# Altium schematic sheet Revisies.SchDoc: Ulticontroller
size A4; CompanyName: Ultimaker; Revision: 1994-E
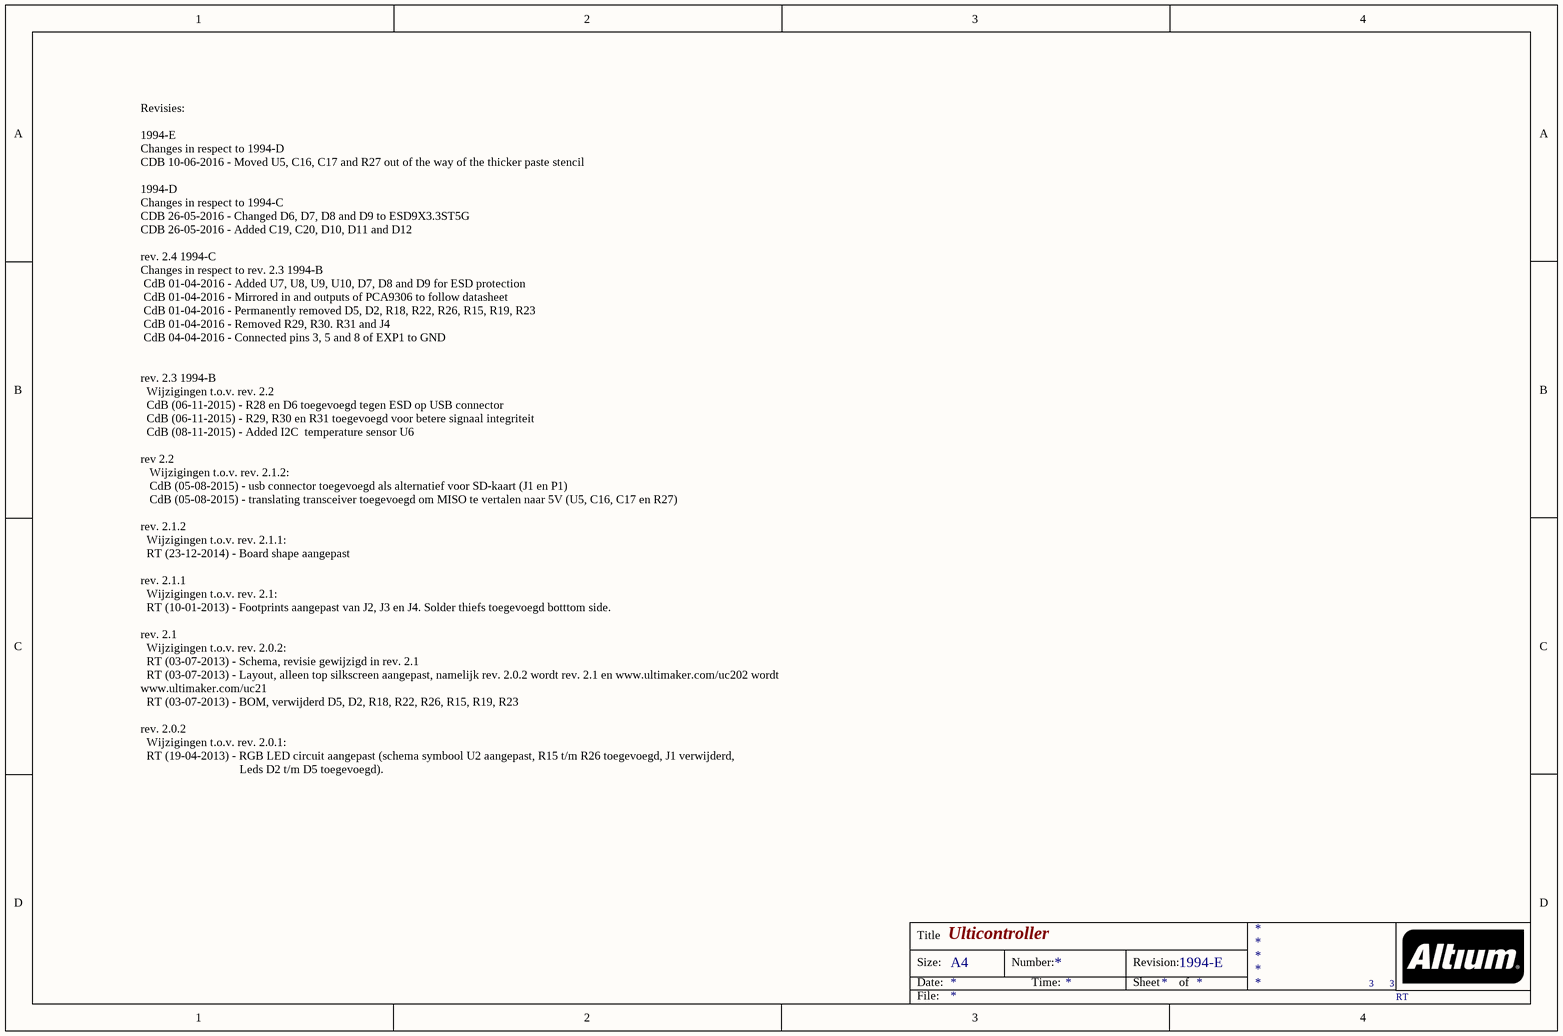
[diagram p0: Revisies.SchDoc]

## Notes on the sheet
- Revisies:
  1994-E
  Changes in respect to 1994-D
  CDB 10-06-2016 - Moved U5, C16, C17 and R27 out of the way of the thicker paste stencil
  1994-D
  Changes in respect to 1994-C
  CDB 26-05-2016 - Changed D6, D7, D8 and D9 to ESD9X3.3ST5G
  CDB 26-05-2016 - Added C19, C20, D10, D11 and D12
  rev. 2.4 1994-C
  Changes in respect to rev. 2.3 1994-B
  CdB 01-04-2016 - Added U7, U8, U9, U10, D7, D8 and D9 for ESD protection
  CdB 01-04-2016 - Mirrored in and outputs of PCA9306 to follow datasheet
  CdB 01-04-2016 - Permanently removed D5, D2, R18, R22, R26, R15, R19, R23
  CdB 01-04-2016 - Removed R29, R30. R31 and J4
  CdB 04-04-2016 - Connected pins 3, 5 and 8 of EXP1 to GND
  rev. 2.3 1994-B
  Wijzigingen t.o.v. rev. 2.2
  CdB (06-11-2015) - R28 en D6 toegevoegd tegen ESD op USB connector
  CdB (06-11-2015) - R29, R30 en R31 toegevoegd voor betere signaal integriteit
  CdB (08-11-2015) - Added I2C  temperature sensor U6
  rev 2.2
  Wijzigingen t.o.v. rev. 2.1.2:
  CdB (05-08-2015) - usb connector toegevoegd als alternatief voor SD-kaart (J1 en P1)
  CdB (05-08-2015) - translating transceiver toegevoegd om MISO te vertalen naar 5V (U5, C16, C17 en R27)
  rev. 2.1.2
  Wijzigingen t.o.v. rev. 2.1.1:
  RT (23-12-2014) - Board shape aangepast
  rev. 2.1.1
  Wijzigingen t.o.v. rev. 2.1:
  RT (10-01-2013) - Footprints aangepast van J2, J3 en J4. Solder thiefs toegevoegd botttom side.
  rev. 2.1
  Wijzigingen t.o.v. rev. 2.0.2:
  RT (03-07-2013) - Schema, revisie gewijzigd in rev. 2.1
  RT (03-07-2013) - Layout, alleen top silkscreen aangepast, namelijk rev. 2.0.2 wordt rev. 2.1 en www.ultimaker.com/uc202 wordt                                      www.ultimaker.com/uc21
  RT (03-07-2013) - BOM, verwijderd D5, D2, R18, R22, R26, R15, R19, R23
  rev. 2.0.2
  Wijzigingen t.o.v. rev. 2.0.1:
  RT (19-04-2013) - RGB LED circuit aangepast (schema symbool U2 aangepast, R15 t/m R26 toegevoegd, J1 verwijderd,
  Leds D2 t/m D5 toegevoegd).
  RT (19-04-2013) - SD-card pin 12 aan GND (lag aan de 3,3V).
  RT (19-04-2013) - De reset lijn van J2 moet via de 74HC4050 naar het display lopen. Pin 7 van J2 naar pin 9 van de 74HC4050,
  en dan van pin 10 naar de reset (pin 9) van het display.
  RT (24-04-2013) - De card-reader 3,2mm naar links
  RT (24-04-2013) - De encoder 3,2mm naar links
  RT (24-04-2013) - H1 t/m H4 verwijderd, SP1 t/m SP4 toegevoegd
- 3
- RT
- Title
- Size:
- Date:
- A4
- Number:
- Time:
- Revision:
- Sheet
- of
- File: